# Altium schematic sheet LCD_ADS131A04.SchDoc
size A4; SheetNumber: 8; SheetTotal: 8
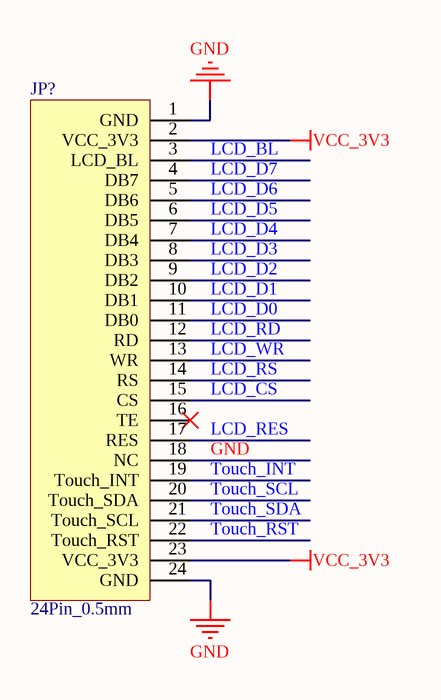
[diagram p0: LCD_ADS131A04.SchDoc]

## Parts
JP?  24Pin_0.5mm  [FPC0.5-WT-24P]

## Nets
GND: JP?.1(GND) JP?.18(NC) JP?.24(GND)
VCC_3V3: JP?.2(VCC_3V3) JP?.23(VCC_3V3)
LCD_BL: JP?.3(LCD_BL)
LCD_CS: JP?.15(CS)
LCD_D0: JP?.11(DB0)
LCD_D1: JP?.10(DB1)
LCD_D2: JP?.9(DB2)
LCD_D3: JP?.8(DB3)
LCD_D4: JP?.7(DB4)
LCD_D5: JP?.6(DB5)
LCD_D6: JP?.5(DB6)
LCD_D7: JP?.4(DB7)
LCD_RD: JP?.12(RD)
LCD_RES: JP?.17(RES)
LCD_RS: JP?.14(RS)
LCD_WR: JP?.13(WR)
Touch_INT: JP?.19(Touch_INT)
Touch_RST: JP?.22(Touch_RST)
Touch_SCL: JP?.20(Touch_SDA)
Touch_SDA: JP?.21(Touch_SCL)

Not connected (* = marked no-connect by the designer): JP? 16(TE)*

## Library data of the parts
JP? = 屏幕板FPC: 屏幕板外接座